# EAGLE design Opto-coupler_SMD-OM (EAGLE 8.3.1)
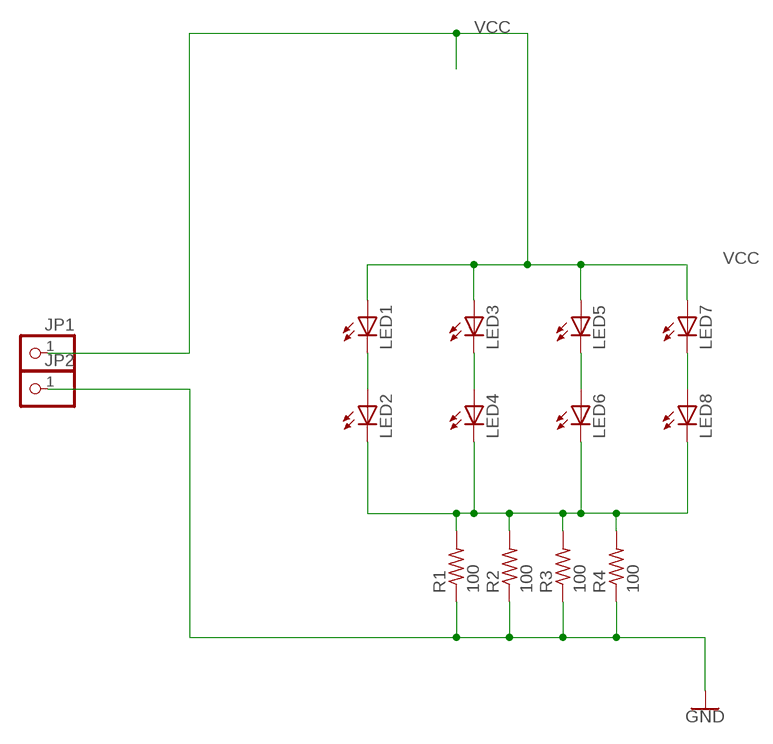
[diagram p0: schematic, sheet 1]

## Parts
JP1  PINHD-1X1  [1X01]
JP2  PINHD-1X1  [1X01]
LED1  LEDCHIPLED_0603  [CHIPLED_0603]
LED2  LEDCHIPLED_0603  [CHIPLED_0603]
LED3  LEDCHIPLED_0603  [CHIPLED_0603]
LED4  LEDCHIPLED_0603  [CHIPLED_0603]
LED5  LEDCHIPLED_0603  [CHIPLED_0603]
LED6  LEDCHIPLED_0603  [CHIPLED_0603]
LED7  LEDCHIPLED_0603  [CHIPLED_0603]
LED8  LEDCHIPLED_0603  [CHIPLED_0603]
R1  100  R-US_R0603  [R0603]
R2  100  R-US_R0603  [R0603]
R3  100  R-US_R0603  [R0603]
R4  100  R-US_R0603  [R0603]

## Nets
GND: JP2.1 R1.1 R2.1 R3.1 R4.1
N$2: LED1.C LED2.A
N$3: LED2.C LED4.C LED6.C LED8.C R1.2 R2.2 R3.2 R4.2
N$4: LED3.C LED4.A
N$6: LED5.C LED6.A
N$7: LED7.C LED8.A
VCC: JP1.1 LED1.A LED3.A LED5.A LED7.A

## Library data of the parts
JP1 JP2 = pinhead:PINHD-1X1: PIN HEADER
LED1-LED8 = adafruit:LED: LED OSRAM: - CHIPLED LG R971, LG N971, LY N971, LG Q971, LY Q971, LO R971, LY R971 LH N974, LH R974 LS Q976, LO Q976, LY Q976 LO Q996 - Hyper CHIPLED LW Q18S LB Q993, LB Q99A, LB R99A - SideLED LS A670, LO A670, LY A670, LG A670, LP A670 LB A673, LV A673, LT A673, LW A673 LH A674 LY A675 LS A676, LA A676, LO A676, LY A676, LW A676 LS A679, LY A679, LG A679 - Hyper Micro SIDELED® LS Y876, LA Y876, LO Y876, LY Y876 LT Y87S - SmartLED LW L88C, LW L88S LB L89C, LB L89S, LG L890 LS L89K, LO L89K, LY L89K LS L896, LA L896, LO L896, LY L896 - TOPLED LS T670, LO T670, LY T670, LG T670, LP T670 LSG T670, LSP T670, LSY T670, LOP T670, LYG T670 LG T671, LOG T671, LSG T671 LB T673, LV T673, LT T673, LW T673 LH T674 LS T676, LA T676, LO T676, LY T676, LB T676, LH T676, LSB T676, LW T676 LB T67C, LV T67C, LT T67C, LS T67K, LO T67K, LY T67K, LW E67C LS E67B, LA E67B, LO E67B, LY E67B, LB E67C, LV E67C, LT E67C LW T67C LS T679, LY T679, LG T679 LS T770, LO T770, LY T770, LG T770, LP T770 LB T773, LV T773, LT T773, LW T773 LH T774 LS E675, LA E675, LY E675, LS T675 LS T776, LA T776, LO T776, LY T776, LB T776 LHGB T686 LT T68C, LB T68C - Hyper Mini TOPLED® LB M676 - Mini TOPLED Santana® LG M470 LS M47K, LO M47K, LY M47K Source: http://www.osram.convergy.de/
R1-R4 = adafruit:R-US_: RESISTOR, American symbol

## Board
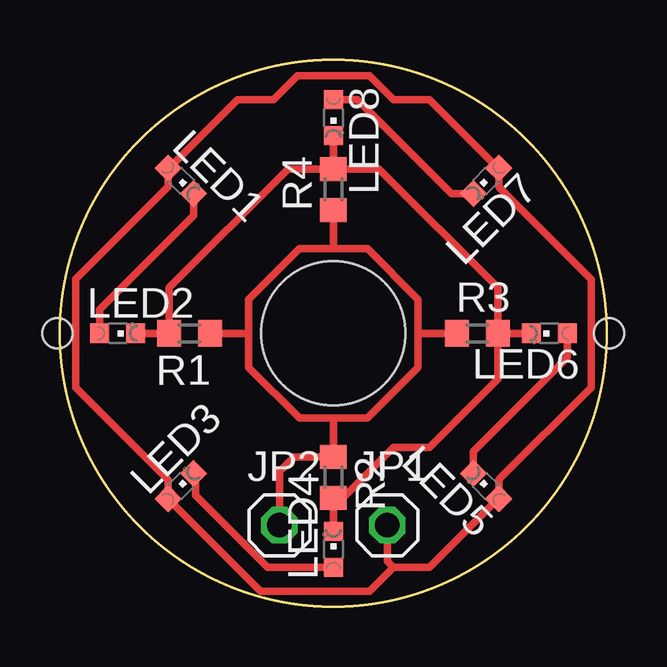
[diagram p1: board, top side]

Size 22.8 x 22.8 mm. Coordinates in mm from the lower left corner, seen from the top.
Outline: circle at 11.4,11.4 radius 11.4
Copper layers (1*16): Top 0.035mm / dielectric 1.5mm / Bottom 0.035mm
Design rules "OthermillDRC_1_64_v2": minimum track width 16mil, minimum drill 31mil, track to track 0.39878125mm, track to pad 0.39878125mm, pad to pad 0.39878125mm, via to via 0.39878125mm, smd to smd 0mil, copper to edge 0mil, drill to drill 1mil, minimum pad ring 0mil, minimum via ring 15mil, stop-mask expansion 1mil, vias tented up to drill 30mil, thermal gap 10mil
Holes 6 mm at 11.4,11.4
Holes 1.25 mm at 22.9,11.4 -0.1,11.4

### Footprints (pad centres in the part's own frame; a part is rotated, then mirrored left to right if it is on the bottom)
1X01 = drill 1.016 octagon: 1 0,0
CHIPLED_0603 = smd 0.8 x 0.8: A 0,-0.75; C 0,0.75
R0603 = smd 1 x 1.1: 1 -0.85,0; 2 0.85,0

### Placement (x,y rotation side)
JP1  13.65,3.4 0 top
JP2  9.15,3.4 0 top
LED1  5.04,17.76 225 top
LED2  2.4,11.4 270 top
LED3  5.04,5.04 315 top
LED4  11.4,2.4 0 top
LED5  17.76,5.04 45 top
LED6  20.4,11.4 90 top
LED7  17.76,17.76 135 top
LED8  11.4,20.4 180 top
R1  5.4,11.4 180 top
R2  11.4,5.4 270 top
R3  17.4,11.4 0 top
R4  11.4,17.4 90 top

### Tracks (layer width: path | path; a pad name or v marks a point on that pad's centre or on a via)
GND
  Top 0.305: 11.51,14.94 9.99,14.94 7.86,12.81 7.86,11.47 | 11.51,14.94 12.81,14.94 14.94,12.81 14.94,11.39 | 14.94,11.39 14.94,9.99 12.81,7.86 11.46,7.86 | 11.46,7.86 9.99,7.86 7.86,9.99 7.86,11.47 | R1.1 7.8,11.4 7.86,11.47 | 11.46,7.86 11.4,7.81 R2.1 9.75,6.25 9.15,5.65 JP2.1 | R3.1 14.94,11.4 14.94,11.39 | R4.1 11.4,15.05 11.51,14.94
N$2
  Top 0.305: LED1.C 5.57,16.32 1.65,12.4 LED2.A
N$3
  Top 0.305: LED6.C R3.2 | LED4.C R2.2 11.8,4.55 13.9,6.65 15.4,6.65 18.25,9.5 R3.2 | LED2.C R1.2 4.55,13.3 9.5,18.25 R4.2 | LED8.C R4.2 | R4.2 13.3,18.25 18.25,13.3 R3.2
N$4
  Top 0.305: LED4.A 8.65,1.65 5.65,4.65 5.65,5.48 LED3.C
N$6
  Top 0.305: LED5.C 17.23,6.48 21.15,10.4 LED6.A
N$7
  Top 0.305: LED7.C 16.32,17.23 12.4,21.15 LED8.A
VCC
  Top 0.305: 13.9,1.65 15.4,1.65 18.26,4.51 LED5.A 18.29,5.28 18.35,5.34 18.35,5.35 22.15,9.15 22.15,13.65 18.35,17.45 18.35,17.46 18.29,17.52 LED7.A 18.26,18.29 15.4,21.15 13.9,21.15 12.9,22.15 9.9,22.15 8.9,21.15 7.4,21.15 4.54,18.29 LED1.A 4.51,17.52 0.65,13.66 0.65,9.14 4.51,5.28 LED3.A 8.36,0.65 12.9,0.65 13.9,1.65 | JP1.1 13.65,1.9 13.9,1.65